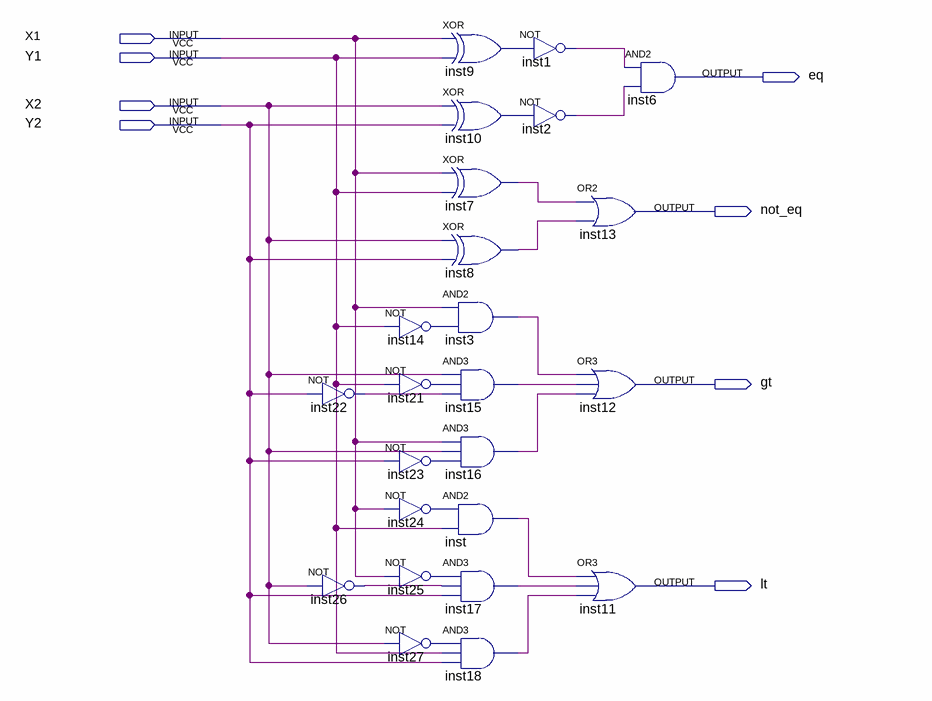
[diagram p0: schematic sheet]
// Quartus schematic two_bit_comparator.bdf as structural Verilog: 24 symbols, 8 pins
module two_bit_comparator (
  input  X1,
  input  Y1,
  input  X2,
  input  Y2,
  output eq,
  output not_eq,
  output gt,
  output lt
);

  wire inst1_out, inst2_out, inst3_out, inst7_out, inst8_out, inst9_out, inst10_out, inst14_out, inst15_out,
       inst16_out, inst17_out, inst18_out, inst21_out, inst22_out, inst23_out, inst24_out, inst25_out,
       inst26_out, inst27_out, inst_out;

  not inst22 (inst22_out, Y2);
  not inst26 (inst26_out, X2);
  not inst14 (inst14_out, Y1);
  not inst21 (inst21_out, Y1);
  not inst23 (inst23_out, Y2);
  not inst24 (inst24_out, X1);
  not inst25 (inst25_out, X1);
  not inst27 (inst27_out, X2);
  xor inst9 (inst9_out, X1, Y1);
  xor inst10 (inst10_out, X2, Y2);
  xor inst7 (inst7_out, X1, Y1);
  xor inst8 (inst8_out, X2, Y2);
  and inst3 (inst3_out, X1, inst14_out);
  and inst15 (inst15_out, X2, inst21_out, inst22_out);
  and inst16 (inst16_out, X1, X2, inst23_out);
  and inst (inst_out, inst24_out, Y1);
  and inst17 (inst17_out, inst25_out, inst26_out, Y2);
  and inst18 (inst18_out, inst27_out, Y1, Y2);
  not inst1 (inst1_out, inst9_out);
  not inst2 (inst2_out, inst10_out);
  or inst13 (not_eq, inst7_out, inst8_out);
  or inst12 (gt, inst3_out, inst15_out, inst16_out);
  or inst11 (lt, inst_out, inst17_out, inst18_out);
  and inst6 (eq, inst1_out, inst2_out);
endmodule
